# EAGLE design NRF24L01-RevB (EAGLE 6.4)
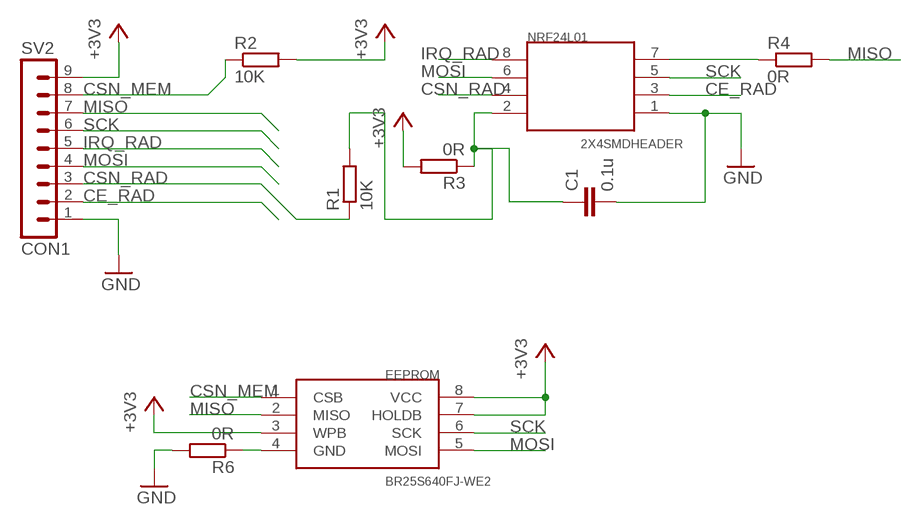
[diagram p0: schematic, sheet 1]

## Parts
C1  0.1u  C-EUC1206K  [C1206K]
EEPROM  BR25S640FJ-WE2  [SO8]
NRF24L01  2X4SMDHEADER  [TSM-110-XX-XXX-DV]
R1  10K  R-EU_R1206  [R1206]
R2  10K  R-EU_R1206  [R1206]
R3  0R  R-EU_R1206  [R1206]
R4  0R  R-EU_R1206  [R1206]
R6  0R  R-EU_R1206  [R1206]
SV2  CON1  MA09-1W  [MA09-1W]

## Nets
+3V3: EEPROM.3(WPB) EEPROM.7(HOLDB) EEPROM.8(VCC) R2.2 R3.2 SV2.9
CE_RAD: NRF24L01.3 SV2.2
CSN_MEM: EEPROM.1(CSB) R2.1 SV2.8
CSN_RAD: NRF24L01.4 R1.1 SV2.3
GND: C1.2 NRF24L01.1 R6.2 SV2.1
IRQ_RAD: NRF24L01.8 SV2.5
MISO: EEPROM.2(MISO) R4.2 SV2.7
MOSI: EEPROM.5(MOSI) NRF24L01.6 SV2.4
N$1: C1.1 NRF24L01.2 R1.2 R3.1
N$2: NRF24L01.7 R4.1
N$4: EEPROM.4(GND) R6.1
SCK: EEPROM.6(SCK) NRF24L01.5 SV2.6

## Library data of the parts
C1 = rcl:C-EU: CAPACITOR, European symbol
EEPROM = eeprom:BR25S640FJ-WE2
NRF24L01 = Header:2X4SMDHEADER
R1-R4 R6 = resistor:R-EU_: RESISTOR, European symbol
SV2 = con-lstb:MA09-1W: PIN HEADER; OC_FARNELL: unknown; OC_NEWARK: unknown

## Board
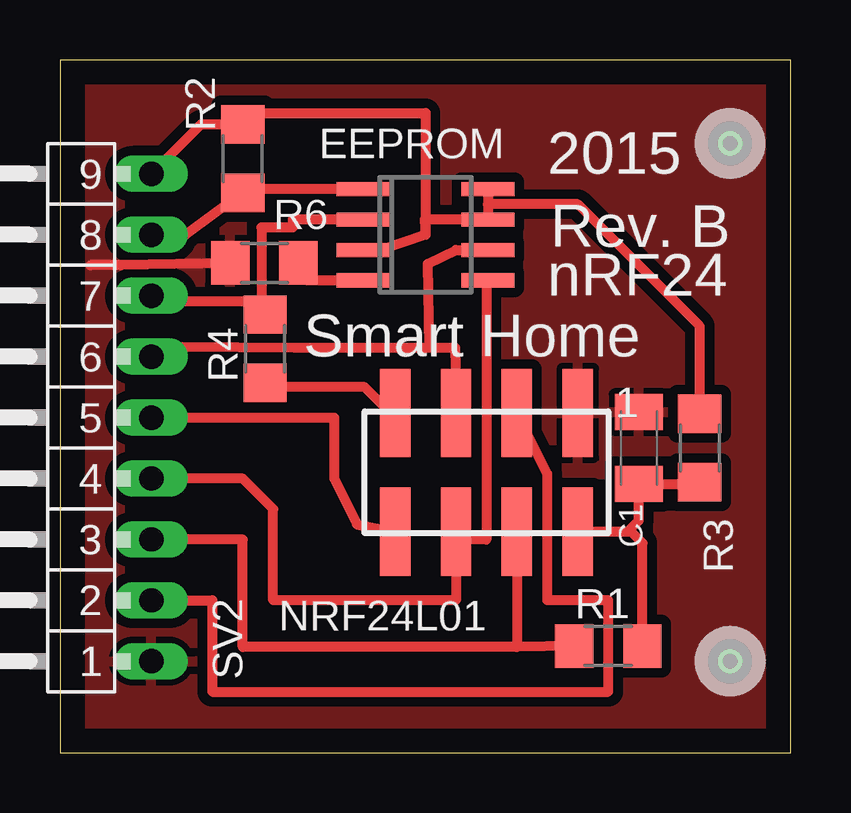
[diagram p1: board, top side]

Size 30.46 x 28.88 mm. Coordinates in mm from the lower left corner, seen from the top.
Outline: 0,0 30.46,0 30.46,28.88 0,28.88 0,0
Copper layers (1*16): Top 0.035mm / dielectric 1.5mm / Bottom 0.035mm
Design rules "default": minimum track width 10mil, minimum drill 24mil, track to track 8mil, track to pad 8mil, pad to pad 8mil, via to via 8mil, smd to smd 8mil, copper to edge 40mil, drill to drill 8mil, minimum pad ring 10mil, minimum via ring 8mil, stop-mask expansion 4mil, vias tented up to drill 0mil, thermal gap 10mil

### Footprints (pad centres in the part's own frame; a part is rotated, then mirrored left to right if it is on the bottom)
C1206K = smd 1.5 x 2: 1 -1.5,0; 2 1.5,0
SO8 = smd 0.6 x 2.2: 1 -1.905,-2.6; 2 -0.635,-2.6; 3 0.635,-2.6; 4 1.905,-2.6; 5 1.905,2.6; 6 0.635,2.6; 7 -0.635,2.6; 8 -1.905,2.6
TSM-110-XX-XXX-DV = smd 1.27 x 3.683: 1 -3.81,-2.731; 2 -3.81,2.223; 3 -1.27,-2.731; 4 -1.27,2.223; 5 1.27,-2.731; 6 1.27,2.223; 7 3.81,-2.731; 8 3.81,2.223
R1206 = smd 1.6 x 1.803: 1 -1.422,0; 2 1.422,0
MA09-1W = drill 1.016 long: 1 -10.16,0; 2 -7.62,0; 3 -5.08,0; 4 -2.54,0; 5 0,0; 6 2.54,0; 7 5.08,0; 8 7.62,0; 9 10.16,0

### Placement (x,y rotation side)
C1  24.13,12.7 90 top
EEPROM  15.24,21.59 270 top
NRF24L01  17.78,11.43 180 top
R1  22.86,4.45 0 top
R2  7.62,24.77 90 top
R3  26.67,12.7 90 top
R4  8.55,16.84 90 top
R6  8.52,20.42 180 top
SV2  3.81,13.97 90 top

### Tracks (layer width: path | path; a pad name or v marks a point on that pad's centre or on a via)
+3V3
  Top 0.406: EEPROM.8 17.84,22.86 | 17.84,22.86 EEPROM.7 15.21,22.23 15.24,21.59 | SV2.9 5.87,26.19 R2.2 8.1,26.67 15.24,26.67 15.24,21.59 | 15.24,21.59 13.34,20.95 EEPROM.3 | R3.2 26.67,17.78 21.59,22.86 17.84,22.86
CE_RAD
  Top 0.406: SV2.2 6.35,6.35 6.35,2.54 22.86,2.54 22.86,6.35 20.32,6.35 20.32,11.62 NRF24L01.3
CSN_MEM
  Top 0.406: EEPROM.1 8.41,23.5 R2.1 5.23,21.59 SV2.8
CSN_RAD
  Top 0.406: NRF24L01.4 19.05,4.41 | 19.05,4.41 7.62,4.41 7.62,8.89 SV2.3 | R1.1 19.05,4.41
GND
  Top 0.406: R6.2 2.54,20.32 1.27,20.32
  pour Top (isolate 0.406): 0,27.94 0,-1.27 34.29,-1.27 34.29,27.94
IRQ_RAD
  Top 0.406: SV2.5 11.43,13.97 11.43,11.43 12.38,9.53 NRF24L01.8
MISO
  Top 0.406: EEPROM.2 9.7,22.23 9.7,21.9 8.4,21.9 8.4,18.8 8.26,18.8 | 8.26,18.8 R4.2 | 8.26,18.8 3.81,18.8 SV2.7
MOSI
  Top 0.406: EEPROM.5 17.78,19.62 17.78,8.89 16.51,8.89 NRF24L01.6 16.51,6.35 8.89,6.35 8.89,10.16 7.62,11.43 SV2.4
N$1
  Top 0.406: NRF24L01.2 23.66,9.21 23.74,9.28 | 23.74,9.28 24.13,9.68 C1.1 26.59,11.2 R3.1 | R1.2 24.28,8.74 23.74,9.28
N$2
  Top 0.406: NRF24L01.7 13.78,14.16 12.7,15.24 8.74,15.24 R4.1
N$4
  Top 0.406: EEPROM.4 10.31,19.68 R6.1
N$5  (via drill 0.6)
  other vias: 27.94,25.4
N$6  (via drill 0.6)
  other vias: 27.94,3.81
SCK
  Top 0.406: 16.47,16.88 15.4,16.9 15.34,20.39 16.51,20.95 EEPROM.6 | 16.47,16.88 9.79,16.88 5.12,16.91 SV2.6 | 16.47,16.88 16.51,15.24 NRF24L01.5

### Text on the board
tPlace: 2015 | Rev. B | nRF24 | Smart Home